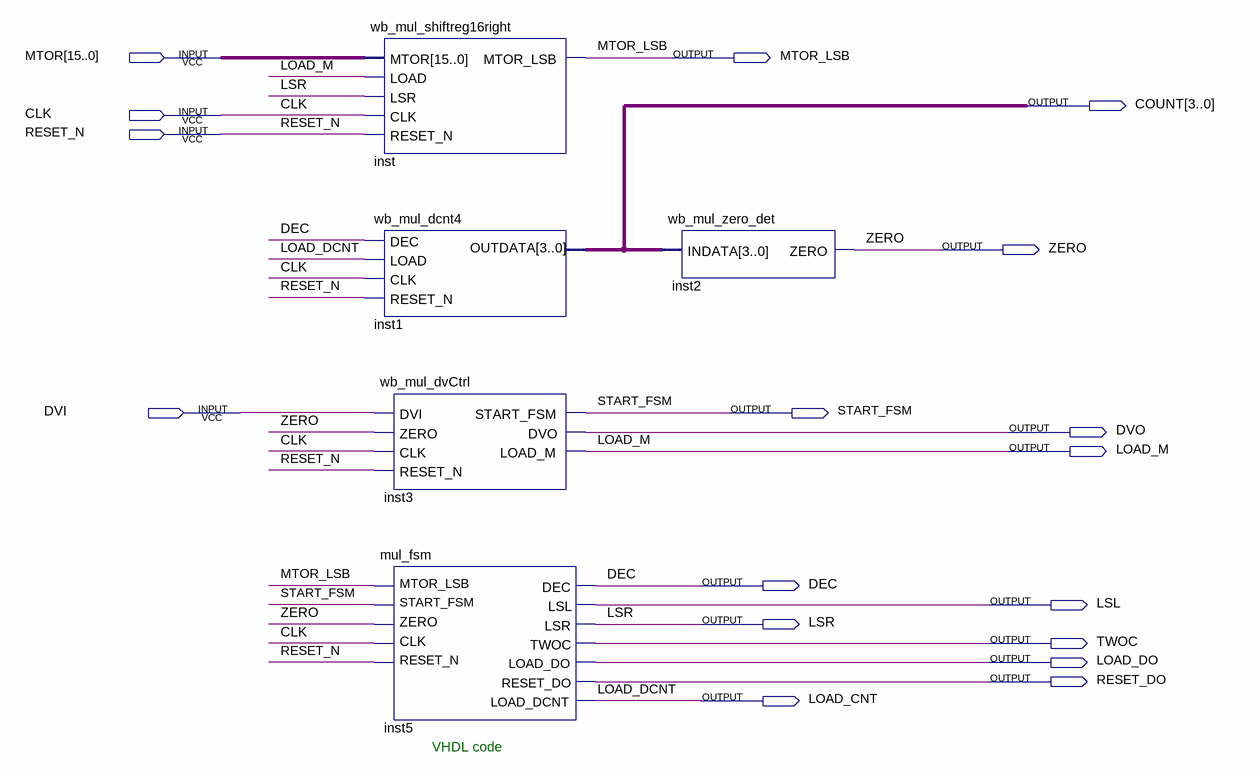
[diagram p0: schematic sheet]
// Quartus schematic mul_control_tst.bdf as structural Verilog: 5 symbols, 17 pins
module mul_control_tst (
  input  [15:0] MTOR,
  input  CLK,
  input  RESET_N,
  input  DVI,
  output MTOR_LSB,
  output [3:0] COUNT,
  output ZERO,
  output START_FSM,
  output DVO,
  output LOAD_M,
  output DEC,
  output LSL,
  output LSR,
  output TWOC,
  output LOAD_DO,
  output RESET_DO,
  output LOAD_CNT
);

  wb_mul_shiftreg16right inst (
    .MTOR(MTOR), .LOAD(LOAD_M), .LSR(LSR), .CLK(CLK), .RESET_N(RESET_N), .MTOR_LSB(MTOR_LSB));
  wb_mul_dcnt4 inst1 (.CLK(CLK), .DEC(DEC), .LOAD(LOAD_CNT), .RESET_N(RESET_N), .OUTDATA(COUNT));
  wb_mul_dvCtrl inst3 (
    .DVI(DVI), .ZERO(ZERO), .CLK(CLK), .RESET_N(RESET_N), .START_FSM(START_FSM), .DVO(DVO), .LOAD_M(LOAD_M));
  mul_fsm inst5 (
    .CLK(CLK), .RESET_N(RESET_N), .MTOR_LSB(MTOR_LSB), .START_FSM(START_FSM), .ZERO(ZERO), .DEC(DEC),
    .LSL(LSL), .LSR(LSR), .TWOC(TWOC), .LOAD_DO(LOAD_DO), .RESET_DO(RESET_DO), .LOAD_DCNT(LOAD_CNT));
  wb_mul_zero_det inst2 (.INDATA(COUNT), .ZERO(ZERO));

  // Other names for the same wires on the sheet: LOAD_DCNT = LOAD_CNT

  // Notes on the sheet:
  //   VHDL code
endmodule
